# EAGLE design attinier85-motherboard-smd-mk-2.2 (EAGLE 7.5.0)
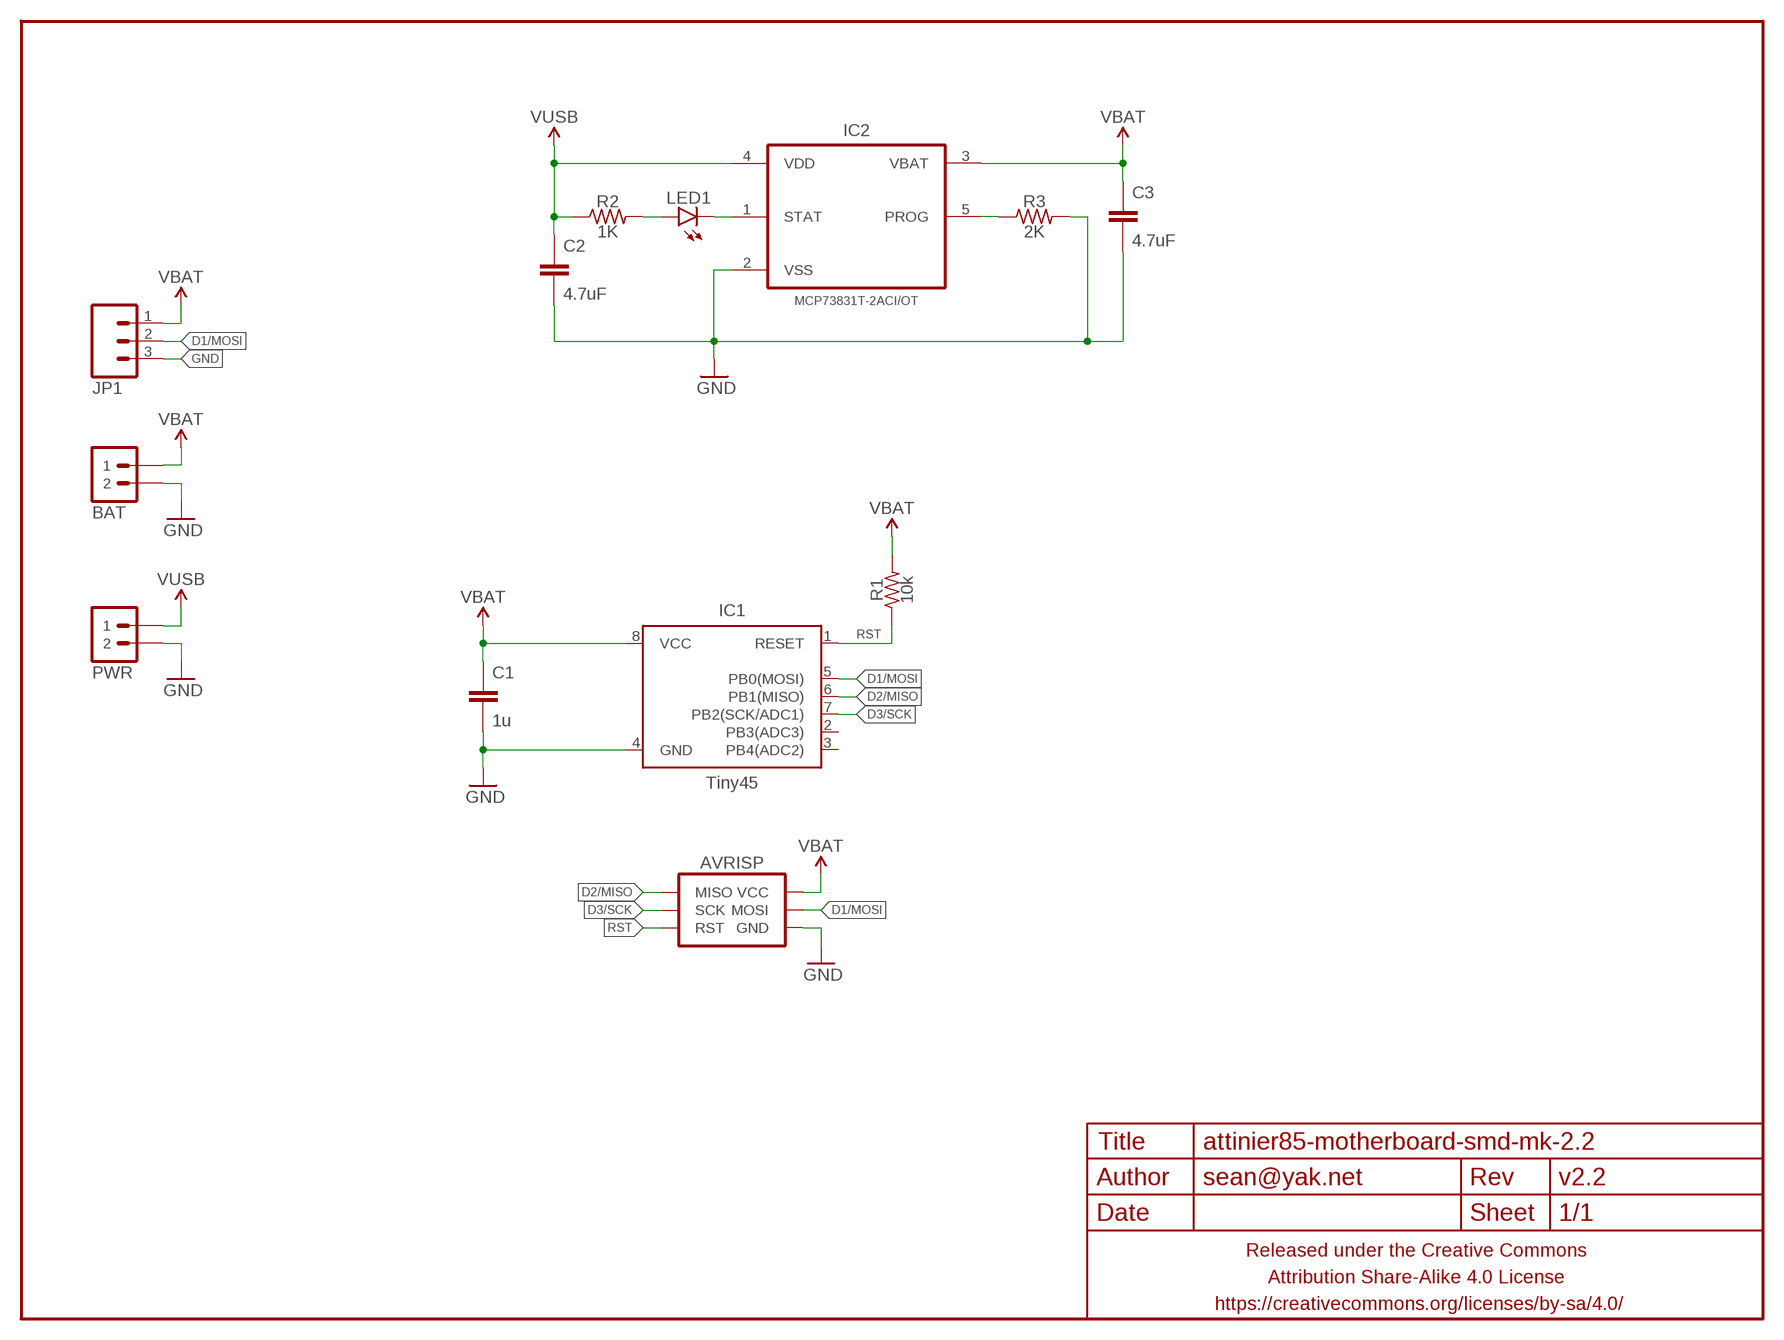
[diagram p0: schematic, sheet 1]

## Parts
AVRISP  AVR_SPI_PRG_6SMD_TEST_POINTS  [2X3_SMD_TEST_POINTS]
BAT  M02PTH-CENTERED  [1X02-CENTER]
C1  1u  CAPACITOR-CERAMICC0603-TIGHTER  [C0603-TIGHTER]
C2  4.7uF  CAPACITOR-CERAMICC0603-TIGHTER  [C0603-TIGHTER]
C3  4.7uF  CAPACITOR-CERAMICC0603-TIGHTER  [C0603-TIGHTER]
FRAME1  FRAME-LETTERNO_PACKAGE  [DUMMY]
IC1  Tiny45  ATTINY45TINY25-20-SOICN  [SO08]
IC2  MCP73831T-2ACI/OT  [SOT95P280X145-5N]
JP1  M03PTH-CENTERED  [1X03-CENTERED]
LED1  LED0603-TIGHT  [LED-0603-TIGHT]
PWR  M02PTH-CENTERED  [1X02-CENTER]
R1  10k  RESISTORR0603-TIGHTER  [R0603-TIGHTER]
R2  1K  RESISTORR0603-TIGHTER  [R0603-TIGHTER]
R3  2K  RESISTORR0603-TIGHTER  [R0603-TIGHTER]

## Nets
D1/MOSI: AVRISP.4(MOSI) IC1.5(PB0(MOSI)) JP1.2
D2/MISO: AVRISP.1(MISO) IC1.6(PB1(MISO))
D3/SCK: AVRISP.3(SCK) IC1.7(PB2(SCK/ADC1))
GND: AVRISP.6(GND) BAT.2 C1.2 C2.2 C3.2 IC1.4(GND) IC2.2(VSS) JP1.3 PWR.2 R3.2
N$1: IC2.1(STAT) LED1.C
N$2: LED1.A R2.2
N$3: IC2.5(PROG) R3.1
RST: AVRISP.5(RST) IC1.1(RESET) R1.1
VBAT: AVRISP.2(VCC) BAT.1 C1.1 C3.1 IC1.8(VCC) IC2.3(VBAT) JP1.1 R1.2
VUSB: C2.1 IC2.4(VDD) PWR.1 R2.1
Unconnected: IC1.2(PB3(ADC3)) IC1.3(PB4(ADC2))

## Library data of the parts
AVRISP = a_parts:AVR_SPI_PRG_6: AVR ISP 6 Pin This is the reduced ISP connector for AVR programming. Common on Arduino. This footprint will take up less PCB space and can be used with a 10-pin to 6-pin adapter such as SKU: BOB-08508 **Special note about "TEST_POINT" package. The stop mask is on the top side, so if you want your programming test points to be on the bottom of your board, make sure to place this package on the bottom side of the board. This also ensure that the orientation to program from the bottom side will be correct.
BAT PWR = a_parts:M02: Standard 2-pin 0.1" header. Use with - straight break away headers ( PRT-00116) - right angle break away headers (PRT-00553) - swiss pins (PRT-00743) - machine pins (PRT-00117) - female headers (PRT-00115) Molex polarized connector foot print use with: PRT-08233 with associated crimp pins and housings. 2.54_SCREWTERM for use with PRT-10571. 3.5mm Screw Terminal footprints for PRT-08084 5mm Screw Terminal footprints for use with PRT-08433
C1-C3 = a_parts:CAPACITOR-CERAMIC: CAPACITOR, European symbol
FRAME1 = a_parts:FRAME-LETTER: Schematic Frame Standard 8.5x11 US Letter frame; DESIGNER: sean@yak.net; VERSION: v2.2
IC1 = a_parts:ATTINY45: Atmel 8-pin 2/4/8kB flash uC
IC2 = a_parts:MCP73831T-2ACI/OT: Charge Management Controller; MPN: MCP73831T-2ACI/OT; OC_FARNELL: 1332158; OC_NEWARK: 56K7045; PACKAGE: SOT-5; SUPPLIER: Microchip
JP1 = a_parts:M03: Header 3 Standard 3-pin 0.1" header. Use with straight break away headers (SKU : PRT-00116), right angle break away headers (PRT-00553), swiss pins (PRT-00743), machine pins (PRT-00117), and female headers (PRT-00115). Molex polarized connector foot print use with SKU : PRT-08232 with associated crimp pins and housings.
LED1 = a_parts:LED: LEDs Standard schematic elements and footprints for 5mm, 3mm, 1206, and 0603 sized LEDs. 5mm - Spark Fun Electronics SKU : COM-00529 (and others)
R1-R3 = a_parts:RESISTOR: RESISTOR, American symbol

## Board
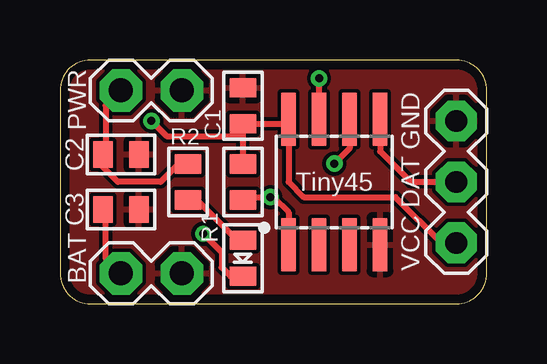
[diagram p1: board, top side]
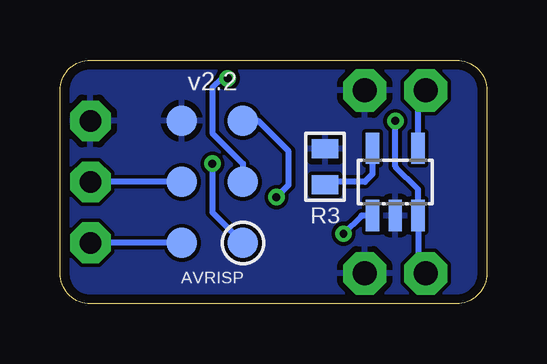
[diagram p2: board, bottom side, seen from below]

Size 17.78 x 10.16 mm. Coordinates in mm from the lower left corner, seen from the top.
Outline: 17.78,1.27 17.78,8.89 arc90 16.51,10.16 1.27,10.16 arc90 0,8.89 0,1.27 arc90 1.27,0 16.51,0 arc90 17.78,1.27
Copper layers (1*16): Top 0.0356mm / dielectric 1.5011mm / Bottom 0.0356mm
Design rules "LaenPCBOrder2": minimum track width 6mil, minimum drill 13mil, track to track 6mil, track to pad 6mil, pad to pad 6mil, via to via 6mil, smd to smd 6mil, copper to edge 15mil, drill to drill 6mil, minimum pad ring 7mil, minimum via ring 7mil, stop-mask expansion 3mil, vias tented up to drill 20mil, thermal gap 10mil

### Footprints (pad centres in the part's own frame; a part is rotated, then mirrored left to right if it is on the bottom)
2X3_SMD_TEST_POINTS = smd 1.27 x 1.27: 1 -2.54,-1.27; 2 -2.54,1.27; 3 0,-1.27; 4 0,1.27; 5 2.54,-1.27; 6 2.54,1.27
1X02-CENTER = drill 1 pad 1.778 octagon: 1 -1.27,0; 2 1.27,0
C0603-TIGHTER = smd 0.8 x 1.1: 1 -0.75,0; 2 0.75,0
SO08 = smd 0.61 x 2.21: 1 -1.905,-2.616; 2 -0.635,-2.616; 3 0.635,-2.616; 4 1.905,-2.616; 5 1.905,2.616; 6 0.635,2.616; 7 -0.635,2.616; 8 -1.905,2.616
SOT95P280X145-5N = smd 1.3 x 0.55: 1 -1.4,0.95; 2 -1.4,0; 3 -1.4,-0.95; 4 1.4,-0.95; 5 1.4,0.95
1X03-CENTERED = drill 0.9 pad 1.7 octagon: 1 -2.54,0; 2 0,0; 3 2.54,0
LED-0603-TIGHT = smd 0.8 x 1.1: A 0.75,0; C -0.75,0
R0603-TIGHTER = smd 0.8 x 1.1: 1 -0.75,0; 2 0.75,0

### Placement (x,y rotation side)
AVRISP  11.43,5.08 90 bottom
BAT  3.81,1.27 0 top
C1  7.62,8.26 90 top
C2  2.54,6.22 0 top
C3  2.54,3.94 0 top
FRAME1  0,0 0 top
IC1  11.43,5.08 0 top
IC2  3.81,5.08 90 bottom
JP1  16.51,5.08 90 top
LED1  7.62,1.91 90 top
PWR  3.81,8.89 0 top
R1  7.62,5.08 90 top
R2  5.33,5.08 270 top
R3  6.73,5.71 90 bottom

### Tracks (layer width: path | path; a pad name or v marks a point on that pad's centre or on a via)
D1/MOSI
  Top 0.254: IC1.5 13.34,6.35 14.61,5.08 JP1.2
  Bottom 0.254: AVRISP.4 JP1.2
D2/MISO  (via drill 0.33)
  Top 0.254: IC1.6 12.06,6.48 v11.43,5.84
  Bottom 0.254: v11.43,5.84 11.43,3.81 AVRISP.1
D3/SCK  (via drill 0.33)
  Top 0.254: IC1.7 v10.79,9.4
  Bottom 0.254: v10.79,9.4 11.05,9.4 11.43,9.02 11.43,7.11 10.16,5.84 AVRISP.3
GND
  pour Bottom: 1.27,10.16 16.51,10.16 arc-90 17.78,8.89 17.78,1.27 arc-90 16.51,0 1.27,0 arc-90 0,1.27 0,8.89 arc-90
  pour Top (rank 6): 0,8.89 0,1.27 arc90 1.27,0 16.51,0 arc90 17.78,1.27 17.78,8.89 arc90 16.51,10.16 1.27,10.16 arc90
N$1  (via drill 0.33)
  Top 0.254: v5.97,2.92 6.73,2.16 6.73,1.52 7.11,1.14 7.61,1.14 LED1.C
  Bottom 0.254: IC2.1 5.21,3.68 v5.97,2.92
N$2
  Top 0.254: R2.2 5.7,4.33 7.38,2.65 LED1.A
N$3
  Bottom 0.254: IC2.5 4.76,5.4 5.08,5.08 6.62,5.08 R3.1
RST  (via drill 0.33)
  Top 0.254: R1.1 7.74,4.45 v8.76,4.45 8.89,4.45 9.53,3.81 IC1.1
  Bottom 0.254: v8.76,4.45 8.26,4.95 8.26,6.35 9.53,7.62 AVRISP.5
VBAT  (via drill 0.33)
  Top 0.254: BAT.1 1.91,1.91 1.91,3.82 C3.1 | v3.81,7.62 4.45,6.99 7.62,6.99 | 7.62,6.99 C1.1 9.33,7.5 | 7.62,6.99 R1.2 | 9.33,7.5 IC1.8 | 9.33,7.5 9.53,7.31 9.53,5.08 10.16,4.45 13.97,4.45 15.88,2.54 JP1.1
  Bottom 0.254: BAT.1 2.86,1.59 IC2.3 2.86,4.76 3.81,5.71 v3.81,7.62 | AVRISP.2 JP1.1
VUSB
  Top 0.254: PWR.1 1.91,8.26 1.91,6.34 C2.1 1.78,6.21 1.78,5.71 2.41,5.08 4.19,5.08 4.94,5.83 R2.1
  Bottom 0.254: IC2.4 2.86,8.57 PWR.1

### Text on the board
tPlace: GND | DAT | VCC